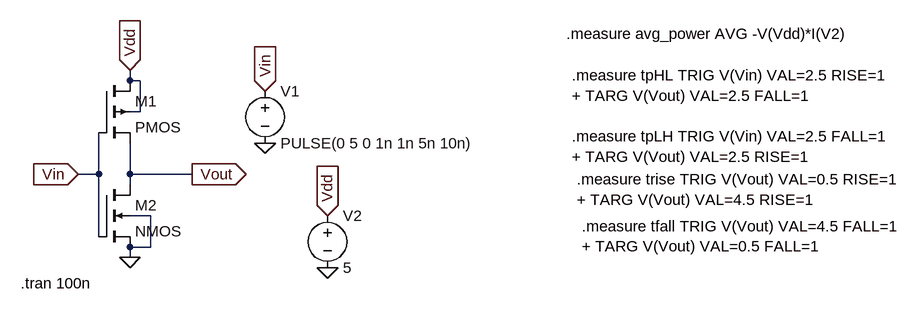
[diagram p0: schematic CMOS.asc]
CMOS.asc, the LTspice schematic file:
Version 4.1
SHEET 1 1384 680
WIRE 160 48 160 32
WIRE 176 48 160 48
WIRE 176 96 176 48
WIRE 176 96 160 96
WIRE 112 192 112 128
WIRE 112 192 80 192
WIRE 160 192 160 144
WIRE 256 192 160 192
WIRE 160 208 160 192
WIRE 192 256 160 256
WIRE 112 288 112 192
WIRE 192 304 192 256
WIRE 192 304 160 304
WIRE 160 320 160 304
FLAG 368 144 0
FLAG 464 336 0
FLAG 160 320 0
FLAG 80 192 Vin
IOPIN 80 192 In
FLAG 368 64 Vin
IOPIN 368 64 In
FLAG 160 32 Vdd
IOPIN 160 32 In
FLAG 464 256 Vdd
IOPIN 464 256 In
FLAG 256 192 Vout
IOPIN 256 192 Out
SYMBOL pmos4 112 48 R0
SYMATTR InstName M1
SYMBOL nmos4 112 208 R0
SYMATTR InstName M2
SYMBOL voltage 368 48 R0
WINDOW 123 0 0 Left 0
WINDOW 39 0 0 Left 0
SYMATTR InstName V1
SYMATTR Value PULSE(0 5 0 1n 1n 5n 10n)
SYMBOL voltage 464 240 R0
WINDOW 123 0 0 Left 0
WINDOW 39 0 0 Left 0
SYMATTR InstName V2
SYMATTR Value 5
TEXT -8 360 Left 2 !.tran 100n
TEXT 832 -24 Left 2 !.measure avg_power AVG -V(Vdd)*I(V2)
TEXT 840 40 Left 2 !.measure tpHL TRIG V(Vin) VAL=2.5 RISE=1\n+ TARG V(Vout) VAL=2.5 FALL=1\n \n.measure tpLH TRIG V(Vin) VAL=2.5 FALL=1\n+ TARG V(Vout) VAL=2.5 RISE=1
TEXT 848 200 Left 2 !.measure trise TRIG V(Vout) VAL=0.5 RISE=1\n+ TARG V(Vout) VAL=4.5 RISE=1
TEXT 856 272 Left 2 !.measure tfall TRIG V(Vout) VAL=4.5 FALL=1\n+ TARG V(Vout) VAL=0.5 FALL=1

The netlist it stands for:
* CMOS.asc
M1 Vdd Vin Vout Vdd PMOS
M2 Vout Vin 0 0 NMOS
V1 Vin 0 PULSE(0 5 0 1n 1n 5n 10n)
V2 Vdd 0 5
.model NMOS NMOS
.model PMOS PMOS
.lib standard.mos
.tran 100n
.measure avg_power AVG -V(Vdd)*I(V2)
.measure tpHL TRIG V(Vin) VAL=2.5 RISE=1
+ TARG V(Vout) VAL=2.5 FALL=1
.measure tpLH TRIG V(Vin) VAL=2.5 FALL=1
+ TARG V(Vout) VAL=2.5 RISE=1
.measure trise TRIG V(Vout) VAL=0.5 RISE=1
+ TARG V(Vout) VAL=4.5 RISE=1
.measure tfall TRIG V(Vout) VAL=4.5 FALL=1
+ TARG V(Vout) VAL=0.5 FALL=1
.backanno
.end

* Results of the author's LTspice run, read from the files saved beside the schematic
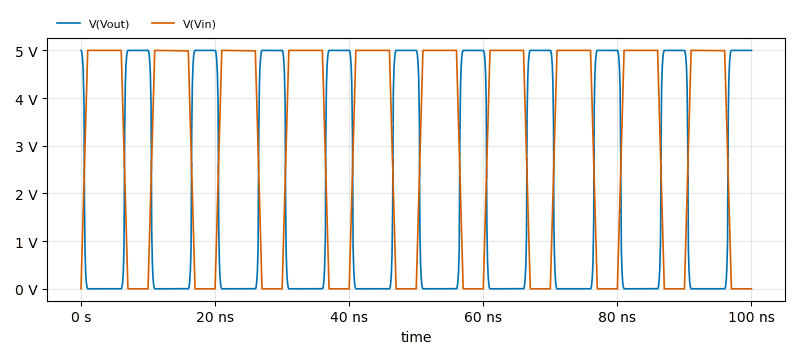
[diagram p1: Transient Analysis of CMOS.asc, plotted from the saved traces]
* Transient Analysis, 1 run:
*   V(Vout): min 0 V, max 5 V, average 2.002 V, rms 3.11 V, last 5 V
*   V(Vin): min 0 V, max 5 V, average 2.999 V, rms 3.764 V, last 0 V
* From the log:
*   avg_power: AVG(-V(Vdd)*I(V2))=2.09376141598e-05 FROM 0 TO 1e-07
*   tphl=-8.24914076996e-12 FROM 4.99999978508e-10 TO 4.91750837738e-10
*   tplh=-1.7761063173e-11 FROM 6.49999997662e-09 TO 6.48223891345e-09
*   trise=3.21780905028e-10 FROM 6.33951051004e-09 TO 6.66129141507e-09
*   tfall=3.20338695092e-10 FROM 3.41194771059e-10 TO 6.61533466152e-10